# Altium project IEEEE ENSIT SB SSCS.PrjPcb
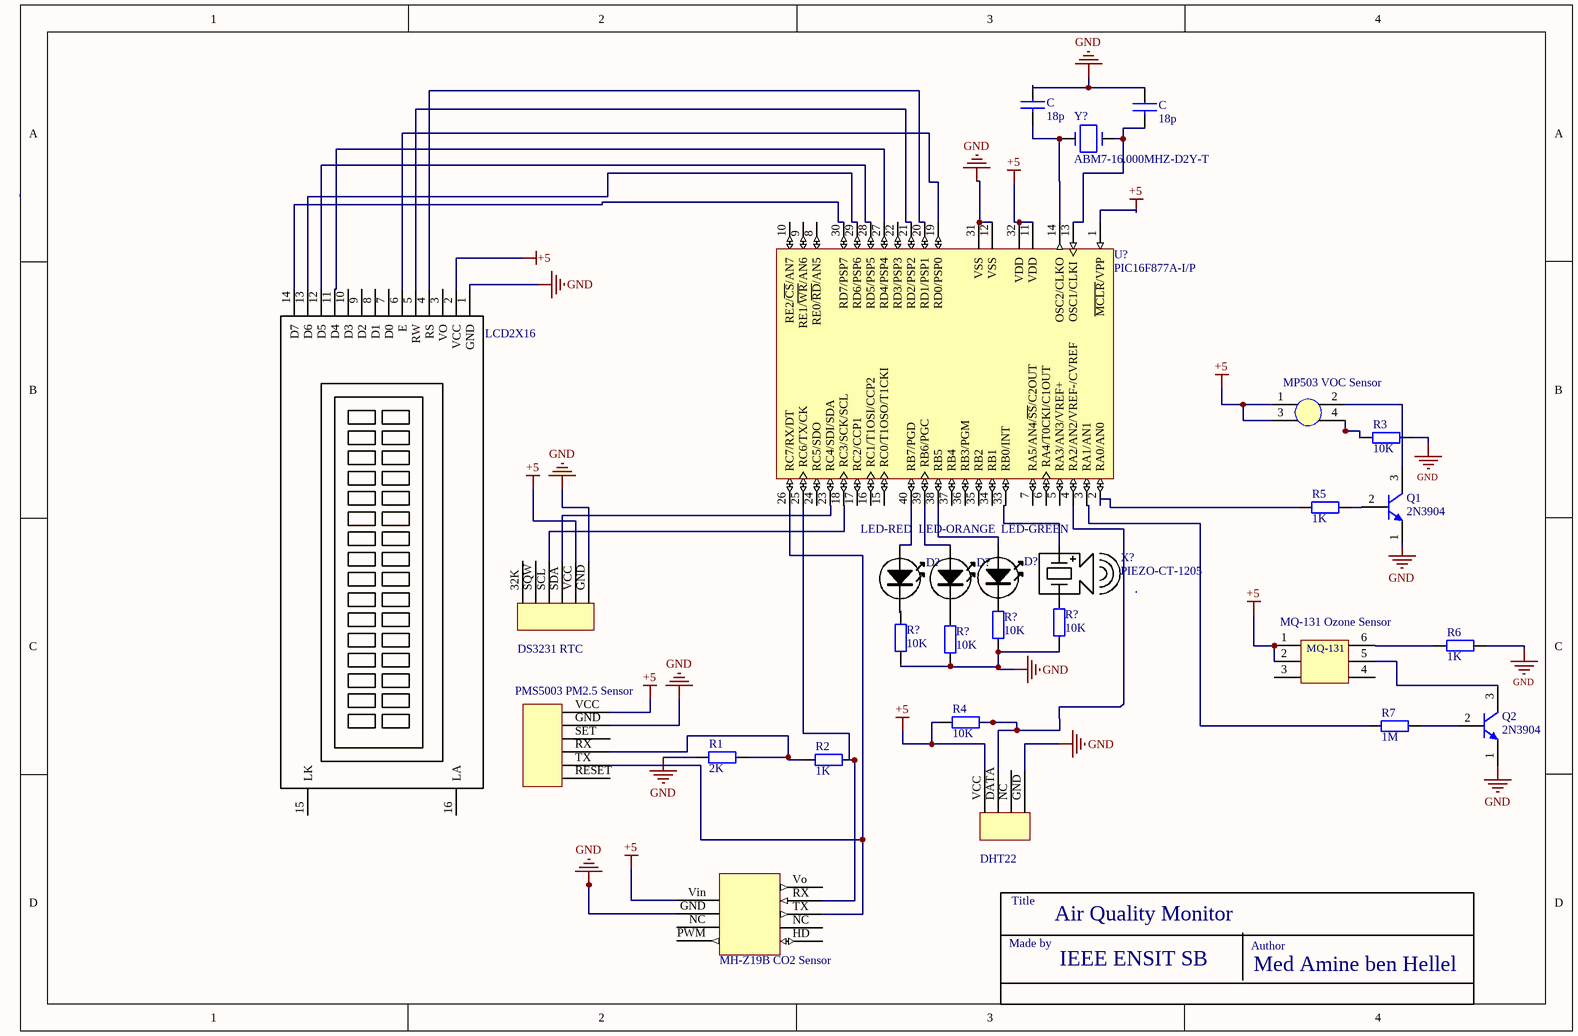
[diagram p0: IEEE SSCS Air Quality Monitor.SchDoc]
1 sheet, 28 parts. Net scope: global (net labels, ports and power ports of the same name join across sheets).
Board file: IEEE SSCS Air Quality Monitor .PcbDoc

## Sheet IEEE SSCS Air Quality Monitor.SchDoc: DIY Air Quality Monitor
size A4; Author: Dejan; Time: DIY Air Quality Monitor

### Parts
(Parts that share a designator on the sheet are numbered #1, #2 ... from top to bottom, then left to right.)
?  LCD2X16
C#1  18p  [C0805]
C#2  18p  [C0805]
D?#1  LED-RED  [LED-5MM-RED]
D?#2  LED-ORANGE  [LED-5MM-GREEN]
D?#3  LED-GREEN  [LED-5MM-GREEN]
DHT22  DHT22  [DHT22]
DS1  DS3231 RTC  [DS3231 RTC]
MH-Z1  MH-Z19B CO2 Sensor  [MH-Z19B CO2 Sensor]
MP1  MP503 VOC Sensor  [MP503 VOC Sensor]
MQ-1  MQ-131 Ozone Sensor  [MQ-131 Ozone Sensor]
PMS1  PMS5003 PM2.5 Sensor  [PMS5003 PM2.5 Sensor]
Q1  2N3904  [ONSC-TO-92-3-29-11]
Q2  2N3904  [ONSC-TO-92-3-29-11]
R1  value 2K  [AXIAL-0.4]  (hidden comment: Res2)
R2  value 1K  [AXIAL-0.4]  (hidden comment: Res2)
R3  value 10K  [AXIAL-0.4]  (hidden comment: Res2)
R4  value 10K  [AXIAL-0.4]  (hidden comment: Res2)
R5  value 1K  [AXIAL-0.4]  (hidden comment: Res2)
R6  value 1K  [AXIAL-0.4]  (hidden comment: Res2)
R7  value 1M  [AXIAL-0.4]  (hidden comment: Res2)
R?#1  value 10K  [AXIAL-0.4]  (hidden comment: Res2)
R?#2  value 10K  [AXIAL-0.4]  (hidden comment: Res2)
R?#3  value 10K  [AXIAL-0.4]  (hidden comment: Res2)
R?#4  value 10K  [AXIAL-0.4]  (hidden comment: Res2)
U?  PIC16F877A-I/P  [PDIP600-P40]
X?  PIEZO-CT-1205  [PIEZO-CT-1205]
Y?  ABM7-16.000MHZ-D2Y-T  [ABM7_v1_1_BIG]

### Nets
+5: ?.2(VCC) DHT22.VCC DS1.VCC MH-Z1.Vin MP1.1 MP1.3 MQ-1.1 MQ-1.2 PMS1.VCC R4.2 U?.1(~{MCLR}/VPP) U?.11(VDD) U?.32(VDD)
GND: ?.1(GND) C#1.1 C#2.1 DHT22.GND DS1.GND MH-Z1.GND PMS1.GND Q1.1(E) Q2.1(E) R1.1 R3.2 R6.2 R?#1.1 R?#2.1 R?#3.1 R?#4.1 U?.12(VSS) U?.31(VSS)
Net?_4: ?.4(RS) U?.20(RD1/PSP1)
Net?_5: ?.5(RW) U?.21(RD2/PSP2)
Net?_6: ?.6(E) U?.19(RD0/PSP0)
Net?_11: ?.11(D4) U?.27(RD4/PSP4)
Net?_12: ?.12(D5) U?.28(RD5/PSP5)
Net?_13: ?.13(D6) U?.29(RD6/PSP6)
Net?_14: ?.14(D7) U?.30(RD7/PSP7)
NetC#1_2: C#1.2 U?.14(OSC2/CLKO) Y?.1
NetC#2_2: C#2.2 U?.13(OSC1/CLKI) Y?.2
NetD?#1_A: D?#1.A U?.40(RB7/PGD)
NetD?#1_K: D?#1.K R?#3.2
NetD?#2_A: D?#2.A U?.39(RB6/PGC)
NetD?#2_K: D?#2.K R?#4.2
NetD?#3_A: D?#3.A U?.38(RB5)
NetDHT22_DATA: DHT22.DATA R4.1 U?.4(RA2/AN2/VREF-/CVREF)
NetDS1_SCL: DS1.SCL U?.18(RC3/SCK/SCL)
NetDS1_SDA: DS1.SDA U?.23(RC4/SDI/SDA)
NetMH-Z1_RX: MH-Z1.RX R2.2 U?.25(RC6/TX/CK)
NetMH-Z1_TX: MH-Z1.TX PMS1.TX U?.26(RC7/RX/DT)
NetMP1_2: MP1.2 Q1.3(C)
NetMP1_4: MP1.4 R3.1
NetMQ-1_5: MQ-1.5 Q2.3(C)
NetMQ-1_6: MQ-1.6 R6.1
NetPMS1_RX: PMS1.RX R1.2 R2.1
NetQ1_2: Q1.2(B) R5.2
NetQ2_2: Q2.2(B) R7.2
NetR5_1: R5.1 U?.2(RA0/AN0)
NetR7_1: R7.1 U?.3(RA1/AN1)
NetU?_33: U?.33(RB0/INT) X?.+

Not connected (* = marked no-connect by the designer): ? 3(VO) 7(D0) 8(D1) 9(D2) 10(D3) 15(LK) 16(LA); D?#3 K; DHT22 NC; DS1 32K SQW; MH-Z1 HD NC PWM Vo; MQ-1 3 4; PMS1 RESET SET; R?#1 2; R?#2 2; U? 5(RA3/AN3/VREF+) 6(RA4/T0CKI/C1OUT) 7(RA5/AN4/~{SS}/C2OUT) 8(RE0/~{RD}/AN5) 9(RE1/~{WR}/AN6) 10(RE2/~{CS}/AN7) 15(RC0/T1OSO/T1CKI) 16(RC1/T1OSI/CCP2) 17(RC2/CCP1) 22(RD3/PSP3) 24(RC5/SDO) 34(RB1) 35(RB2) 36(RB3/PGM) 37(RB4); X? -

### Notes on the sheet
- Title
- Air Quality Monitor
- Made by
- IEEE ENSIT SB
- Author
- Med Amine ben Hellel
- (in symbol MQ-131 Ozone Sensor) MQ-131

### Library data of the parts
C#1 C#2 = C0805C180J5GACTU: CAP CER 18PF 50V 5% NP0 0805; Manufacturer: Kemet; Temperature Coefficient: C0G, NP0; .Creator: MM; .Checked PCB: RF; Supplier 1: Digi-Key; Manufacturer Part Number: C0805C180J5GACTU; RoHS: RoHS Compliant; Category: Capacitors; Stock 1: 39241; Pricing 1: 1=0.11, 10=0.083, 25=0.0588, 50=0.045, 100=0.0381, 250=0.0312, 1000=0.0204 (USD); Packaging: Cut Tape (CT); Capacitance: 18pF; Tolerance: ±5%; Voltage - Rated: 50V; Mounting Type: Surface Mount, MLCC; Operating Temperature: -55°C ~ 125°C; Applications: General Purpose; Ratings: -; Package / Case: 0805 (2012 Metric); Size / Dimension: 0.079" L x 0.049" W (2.00mm x 1.25mm); Height - Seated (Max): -; Thickness (Max): 0.035" (0.88mm); Lead Spacing: -; Features: -; Lead Style: -; ComponentLink1URL: http://www.kemet.com/docfinder?Partnumber=C0805C180J5GACTU; ComponentLink1Description: http://www.kemet.com/docfinder?Partnumber=C0805C180J5GACTU; Supplier Part Number 1: 399-1112-1-ND; .Checked SCH: RF
D?#1 = LED-RED-5MM
D?#2 D?#3 = LED-GREEN-5MM
Q1 Q2 = CMP-2000-05562-1: General Purpose Transistor, NPN Silicon, 200 mA, 60 V, -55 to 150 degC, 3-Pin TO-92, RoHS, Bulk; Manufacturer: ONSemiconductor; Emitter- Base Voltage VEBO: 6V; Maximum Power Dissipation: 625mW; Maximum DC Collector Current: 0.2A; Collector- Emitter Voltage VCEO Max: 40V; Collector- Base Voltage VCBO: 60V; DC Collector/Base Gain hfe Min: 60; Configuration: Single; Collector-Emitter Saturation Voltage: 0.3V; Gain Bandwidth Product fT: 270MHz; Mounting Style: ThroughHole; Package / Case: TO-92-3(TO-226); Mounting Technology: ThroughHole; Minimum Operating Temperature: -65C; Datasheet Version: Rev. 8, 08/2012; Product Category: BipolarTransistors-BJT; Factory Pack Quantity: 5000; Transistor Polarity: NPN; Package Description: 3-Pin Transistor Outline, Body 4.825 x 3.685 mm, Pitch 1.27 mm; RoHS: Details; Datasheet URL: https://datasheet.ciiva.com/4725/2n3903-d-285841-4725808.pdf; Packaging: Bulk; Maximum Operating Temperature: +150C; Package Reference: TO-92-3-29-11; Brand: ONSemiconductor; Manufacturer URL: http://www.onsemi.com/
R1-R7 R?#1-R?#4 = Res2: Resistor; Published: 8-Jun-2000; LatestRevisionDate: 17-Jul-2002; LatestRevisionNote: Re-released for DXP Platform.; PackageReference: AXIAL-0.4; Publisher: Altium Limited; PackageDescription: Axial Device, Thru-Hole; 2 Leads; 0.4 in Pin Spacing
U? = PIC16F877A-I/P: Enhanced FLASH Microcontroller, 8K (x14-Bit words) FLASH, 368 Bytes RAM, 40-Pin PDIP, Standard VDD Range, Industrial Temperature; ComponentAvailability: Unknown. Contact manufacturer to determine status.; Published: 11-Oct-2004; LatestRevisionDate: 29-Jan-2009; LatestRevisionNote: Sch. layout revised. 3D Model Removed.; DatasheetVersion: revB, Oct-2003; PackageVersion: revBB, Aug-2009; PackageReference: PDIP600-P40; Publisher: Altium Limited; PackageDescription: 40-Lead Plastic Dual In-Line (P) - 600 mil Body [PDIP]; Supplier 1: Digi-Key; Supplier Part Number 1: PIC16F877A-I/P-ND; Supplier 2: Farnell; Supplier Part Number 2: 1523966; Supplier 3: Farnell; Supplier Part Number 3: 9761446; ComponentLink1Description: Datasheet; ComponentLink1URL: http://ww1.microchip.com/downloads/en/DeviceDoc/39582b.pdf; ComponentLink2Description: Packaging Specification; ComponentLink2URL: http://www.microchip.com/stellent/groups/techpub_sg/documents/packagingspec/en012702.pdf; ComponentLink3Description: Microchip.com Home; ComponentLink3URL: http://www.microchip.com/
X? = PIEZO-CT-1205: piezo buzzer; Supplier 1: Digi-Key; Supplier Part Number 1: 102-1267-2-ND
Y? = ABM7-16.000MHZ-D2Y-T: CRYSTAL 16MHZ 18PF SMD; Manufacturer: Abracon LLC; Frequency Stability: ±30ppm; Frequency Tolerance: ±20ppm; ESR (Equivalent Series Resistance): 50 Ohm; Operating Mode: Fundamental; .Creator: MM; .Checked PCB: RF; Supplier 1: Digi-Key; Manufacturer Part Number: ABM7-16.000MHZ-D2Y-T; RoHS: RoHS Compliant; Category: Crystals and Oscillators; Stock 1: 5861; Pricing 1: 1=0.96, 10=0.847, 50=0.791, 100=0.7, 500=0.6615 (USD); Packaging: Cut Tape (CT); Type: MHz Crystal; Frequency: 16MHz; Load Capacitance: 18pF; Operating Temperature: -40°C ~ 85°C; Ratings: -; Mounting Type: Surface Mount; Package / Case: 2-SMD; Size / Dimension: 0.236" L x 0.138" W (6.00mm x 3.50mm); Height: 0.055" (1.40mm); ComponentLink1URL: http://www.abracon.com/Resonators/abm7.pdf; ComponentLink1Description: http://www.abracon.com/Resonators/abm7.pdf; Supplier Part Number 1: 535-9840-1-ND; .Checked SCH: RF